# Altium schematic sheet Sheet1.SchDoc
size A3; SheetNumber: 1; SheetTotal: 1
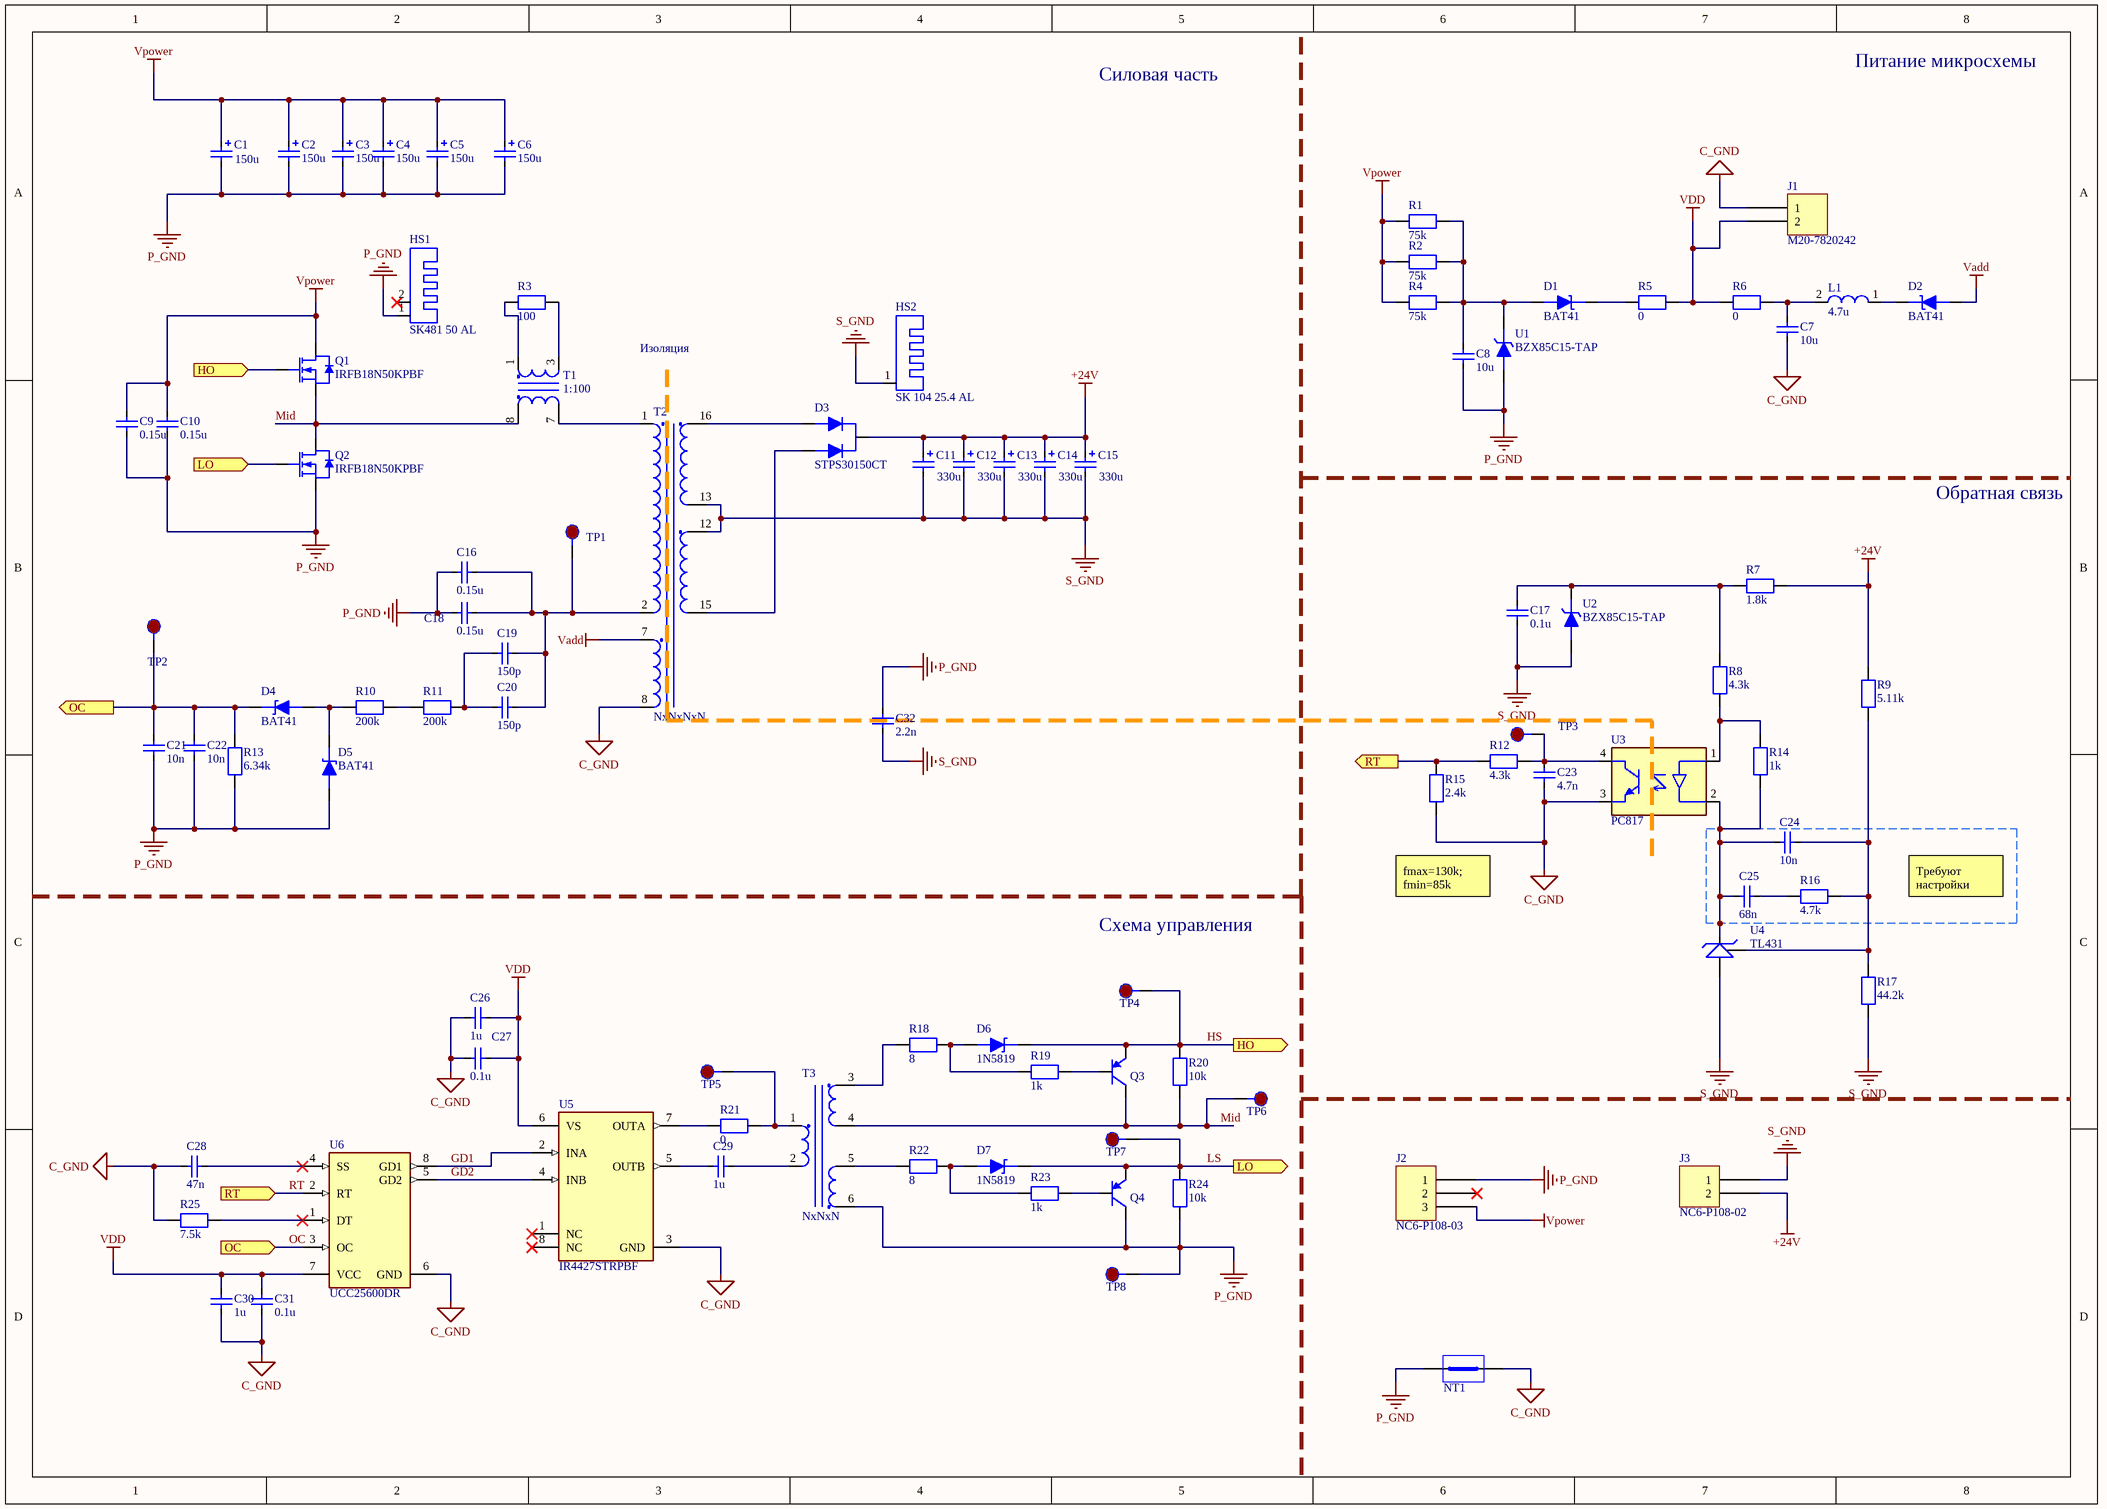
[diagram p0: Sheet1.SchDoc]

## Parts
C1  value 150u  [WCAP-AIL8]  (hidden comment: WCAP-AIL8)
C2  value 150u  [WCAP-AIL8]  (hidden comment: WCAP-AIL8)
C3  value 150u  [WCAP-AIL8]  (hidden comment: WCAP-AIL8)
C4  value 150u  [WCAP-AIL8]  (hidden comment: WCAP-AIL8)
C5  value 150u  [WCAP-AIL8]  (hidden comment: WCAP-AIL8)
C6  value 150u  [WCAP-AIL8]  (hidden comment: WCAP-AIL8)
C7  value 10u  [C322]  (hidden comment: К10-17Б 10 мкФ Y5V)
C8  value 10u  [C322]  (hidden comment: К10-17Б 10 мкФ Y5V)
C9  value 0.15u  [B32654A1154]  (hidden comment: B32654A1154)
C10  value 0.15u  [B32654A1154]  (hidden comment: B32654A1154)
C11  value 330u  [EKZN500ELL331MK16S]  (hidden comment: EKZN500ELL331MK16S)
C12  value 330u  [EKZN500ELL331MK16S]  (hidden comment: EKZN500ELL331MK16S)
C13  value 330u  [EKZN500ELL331MK16S]  (hidden comment: EKZN500ELL331MK16S)
C14  value 330u  [EKZN500ELL331MK16S]  (hidden comment: EKZN500ELL331MK16S)
C15  value 330u  [EKZN500ELL331MK16S]  (hidden comment: EKZN500ELL331MK16S)
C16  value 0.15u  [B32654A1154]  (hidden comment: B32654A1154)
C17  value 0.1u  [C322]  (hidden comment: К10-17Б 0.1 мкФ X7R)
C18  value 0.15u  [B32654A1154]  (hidden comment: B32654A1154)
C19  value 150p  [C322]  (hidden comment: К10-17Б 150pF NP0)
C20  value 150p  [C322]  (hidden comment: К10-17Б 150pF NP0)
C21  value 10n  [C322]  (hidden comment: К10-17Б 10 нФ X7R)
C22  value 10n  [C322]  (hidden comment: К10-17Б 10 нФ X7R)
C23  value 4.7n  [C322]  (hidden comment: К10-17Б 4.7 нФ X7R)
C24  value 10n  [C322]  (hidden comment: К10-17Б 10 нФ X7R)
C25  value 68n  [C322]  (hidden comment: К10-17Б 68 нФ X7R)
C26  value 1u  [CAP_1206]  (hidden comment: Конденсатор керамический smd 1 мкФ X7R)
C27  value 0.1u  [CAP_1206]  (hidden comment: Конденсатор керамический smd 0.1 мкФ X7R)
C28  value 47n  [CAP_1206]  (hidden comment: Конденсатор керамический smd 47 нФ X7R)
C29  value 1u  [C322]  (hidden comment: К10-17Б 1 мкФ X7R)
C30  value 1u  [CAP_1206]  (hidden comment: Конденсатор керамический smd 1 мкФ X7R)
C31  value 0.1u  [CAP_1206]  (hidden comment: Конденсатор керамический smd 0.1 мкФ X7R)
C32  value 2.2n  [F222K47S3NN63J7R]  (hidden comment: F222K47S3NN63J7R)
D1  BAT41  [DO-35]
D2  BAT41  [DO-35]
D3  STPS30150CT  [STPS30150CT]
D4  BAT41  [DO-35]
D5  BAT41  [DO-35]
D6  1N5819  [1N5819]
D7  1N5819  [1N5819]
HS1  SK481 50 AL  [SK481 50 AL]
HS2  SK 104 25.4 AL  [SK 104 25.4 AL]
J1  M20-7820242  [HARWIN M20-7820245]
J2  NC6-P108-03  [TE NC6-P108-03]
J3  NC6-P108-02  [TE NC6-P108-02]
L1  value 4.7u  [EC24]  (hidden comment: Inductor)
NT1  NT  [NT_20mil - TH]  (value not drawn)  (net tie, no BOM)
Q1  IRFB18N50KPBF  [TO-220]
Q2  IRFB18N50KPBF  [TO-220]
Q3  ZXTP2025FTA  [ZXTP2025FTA]  (value not drawn)
Q4  ZXTP2025FTA  [ZXTP2025FTA]  (value not drawn)
R1  value 75k  [C2-23-2]  (hidden comment: MO-200 2 Вт, 75 кОм, 5%)
R2  value 75k  [C2-23-2]  (hidden comment: MO-200 2 Вт, 75 кОм, 5%)
R3  value 100  [CMF55]  (hidden comment: MF-25 0.25 Вт, 100 Ом)
R4  value 75k  [C2-23-2]  (hidden comment: MO-200 2 Вт, 75 кОм, 5%)
R5  value 0  [MF0]  (hidden comment: MF-25 0.25 Вт, 0 Ом)
R6  value 0  [MF0]  (hidden comment: MF-25 0.25 Вт, 0 Ом)
R7  value 1.8k  [MF0]  (hidden comment: MF-25 0.25 Вт, 1.8 кОм)
R8  value 4.3k  [MF0]  (hidden comment: MF-25 0.25 Вт, 4.3 кОм)
R9  value 5.11k  [MF0]  (hidden comment: MF-25 0.25 Вт, 5.11 кОм, 1%)
R10  value 200k  [CMF55]  (hidden comment: CMF-55 0.5 Вт, 200 кОм, 1%)
R11  value 200k  [CMF55]  (hidden comment: CMF-55 0.5 Вт, 200 кОм, 1%)
R12  value 4.3k  [MF0]  (hidden comment: MF-25 0.25 Вт, 4.3 кОм)
R13  value 6.34k  [MF0]  (hidden comment: MF-25 0.25 Вт, 6.34 кОм, 1%)
R14  value 1k  [MF0]  (hidden comment: MF-25 0.25 Вт, 1 кОм, 1%)
R15  value 2.4k  [MF0]  (hidden comment: MF-25 0.25 Вт, 2.4 кОм, 1%)
R16  value 4.7k  [MF0]  (hidden comment: MF-25 0.25 Вт, 4.7 кОм, 1%)
R17  value 44.2k  [MF0]  (hidden comment: MF-25 0.25 Вт, 44.2 кОм, 1%)
R18  value 8  [MF0]  (hidden comment: MF-25 0.25 Вт, 8 Ом, 1%)
R19  value 1k  [MF0]  (hidden comment: MF-25 0.25 Вт, 1 кОм, 1%)
R20  value 10k  [MF0]  (hidden comment: MF-25 0.25 Вт, 10 кОм, 1%)
R21  value 0  [MF0]  (hidden comment: MF-25 0.25 Вт, 0 Ом)
R22  value 8  [MF0]  (hidden comment: MF-25 0.25 Вт, 8 Ом, 1%)
R23  value 1k  [MF0]  (hidden comment: MF-25 0.25 Вт, 1 кОм, 1%)
R24  value 10k  [MF0]  (hidden comment: MF-25 0.25 Вт, 10 кОм, 1%)
R25  value 7.5k  [RESC3016X06N]  (hidden comment: SMD 0.25 Вт, 7.5 кОм, 1%)
T1  1:100  [В82801В205А100]
T2  NxNxNxN  [ETD39 BOBBIN]
T3  NxNxN  [Trans2]
TP1  TP  [Test Point Hole]  (value not drawn)  (no BOM)
TP2  TP  [Test Point Hole]  (value not drawn)  (no BOM)
TP3  TP  [Test Point Hole]  (value not drawn)  (no BOM)
TP4  TP  [Test Point Hole]  (value not drawn)  (no BOM)
TP5  TP  [Test Point Hole]  (value not drawn)  (no BOM)
TP6  TP  [Test Point Hole]  (value not drawn)  (no BOM)
TP7  TP  [Test Point Hole]  (value not drawn)  (no BOM)
TP8  TP  [Test Point Hole]  (value not drawn)  (no BOM)
U1  BZX85C15-TAP  [BZX85C15-TAP]
U2  BZX85C15-TAP  [BZX85C15-TAP]
U3  PC817  [PC817]
U4  TL431  [TL431]
U5  IR4427STRPBF  [DIP-8]
U6  UCC25600DR  [SOIC-8]

## Ports
HO (in, see Sheet1[5C]), HO (out, see Sheet1[1A]), LO (in, see Sheet1[5D]), LO (out, see Sheet1[1B]), OC (in, see Sheet1[1B]), OC (out, see Sheet1[1D]), RT (in, see Sheet1[6C]), RT (out, see Sheet1[1D])

## Nets
+24V: C11.1 C12.1 C13.1 C14.1 C15.1 D3.K J3.2 R7.2 R9.2
C_GND: C7.2 C23.2 C26.1 C27.1 C28.2 C30.1 C31.1 J1.1 NT1.2 R15.1 R25.1 T2.8 U3.3 U5.3(GND) U6.6(GND)
P_GND: C1.2 C2.2 C3.2 C4.2 C5.2 C6.2 C8.2 C9.2 C10.2 C16.1 C18.1 C21.2 C22.2 C32.1 D5.2 HS1.1 J2.1 NT1.1 Q2.S Q4.3(C) R13.1 R24.1 T3.6 TP8.1 U1.2
S_GND: C11.2 C12.2 C13.2 C14.2 C15.2 C17.2 C32.2 HS2.1 J3.1 R17.1 T2.12 T2.13 U2.2 U4.2
Vadd: D2.2 T2.7
VDD: C26.2 C27.2 C30.2 C31.2 J1.2 R5.2 R6.1 U5.6(VS) U6.7(VCC)
Vpower: C1.1 C2.1 C3.1 C4.1 C5.1 C6.1 C9.1 C10.1 J2.3 Q1.D R1.1 R2.1 R4.1
GD1: U5.2(INA) U6.8(GD1)
GD2: U5.4(INB) U6.5(GD2)
HS: D6.1 Q1.G Q3.2(E) R20.2 TP4.1 ; port HO
LS: D7.1 Q2.G Q4.2(E) R24.2 TP7.1 ; port LO
Mid: Q1.S Q2.D Q3.3(C) R20.1 T1.8 T3.4 TP6.1
OC: C21.1 C22.1 D4.1 R13.2 TP2.1 U6.3(OC) ; port OC
RT: R12.2 R15.2 U6.2(RT) ; port RT
NetC7_1: C7.1 L1.2 R6.2
NetC8_1: C8.1 D1.2 R1.2 R2.2 R4.2 U1.1
NetC16_2: C16.2 C18.2 C19.2 C20.2 T2.2 TP1.1
NetC17_1: C17.1 R7.1 R8.2 U2.1
NetC19_1: C19.1 C20.1 R11.2
NetC23_1: C23.1 R12.1 TP3.1 U3.4
NetC24_1: C24.1 C25.1 R14.1 U3.2 U4.3
NetC24_2: C24.2 R9.1 R16.2 R17.2 U4.1
NetC25_2: C25.2 R16.1
NetC28_1: C28.1 U6.4(SS)
NetC29_1: C29.1 U5.5(OUTB)
NetC29_2: C29.2 T3.2
NetD1_1: D1.1 R5.1
NetD2_1: D2.1 L1.1
NetD3_A1: D3.A1(A) T2.16
NetD3_A2: D3.A2(A) T2.15
NetD4_2: D4.2 D5.1 R10.1
NetD6_2: D6.2 R18.2 R19.1
NetD7_2: D7.2 R22.2 R23.1
NetQ3_1: Q3.1(B) R19.2
NetQ4_1: Q4.1(B) R23.2
NetR3_1: R3.1 T1.1
NetR3_2: R3.2 T1.3
NetR8_1: R8.1 R14.2 U3.1
NetR10_2: R10.2 R11.1
NetR18_1: R18.1 T3.3
NetR21_1: R21.1 U5.7(OUTA)
NetR21_2: R21.2 T3.1 TP5.1
NetR22_1: R22.1 T3.5
NetR25_2: R25.2 U6.1(DT)
NetT1_7: T1.7 T2.1

Not connected (* = marked no-connect by the designer): HS1 2*; J2 2*; U5 1(NC)* 8(NC)*

## Notes on the sheet
- Силовая часть
- Питание микросхемы
- Изоляция
- Обратная связь
- fmax=130k; fmin=85k
- Требуют настройки
- Схема управления

## Library data of the parts
C7 C8 = К10-17Б 10 мкФ Y5V: Voltage: 50V
C11-C15 = EKZN500ELL331MK16S: Voltage: 50V
C17 = К10-17Б 0.1 мкФ X7R: Voltage: 50V
C19 C20 = К10-17Б 150pF NP0: Voltage: 500V
C21 C22 C24 = К10-17Б 10 нФ X7R: Voltage: 50V
C23 = К10-17Б 4.7 нФ X7R: Voltage: 50V
C25 = К10-17Б 68 нФ X7R: Voltage: 50V
C26 C30 = SMD 1206 1 мкФ X7R: Voltage: 50V
C27 C31 = SMD 1206 0.1 мкФ X7R: Voltage: 50V
C28 = SMD 1206 47 нФ X7R: Voltage: 50V
C29 = К10-17Б 1 мкФ X7R: Voltage: 50V
J1 = M20-7820242: CONN RCPT 2POS 0.1 GOLD PCB; Manufacturer: Harwin Inc.; Connector Type: Receptacle; Contact Length - Post: 0.118" (3.00mm); Current Rating (Amps): 3A; Mated Stacking Heights: 11.04mm, 12.63mm; Material Flammability Rating: UL94 V-0; Number of Positions: 2; Number of Positions Loaded: All; Pitch - Mating: 0.100" (2.54mm); Style: Board to Board or Cable; Part Number: M20-7820242; ComponentLink1Description: Datasheet; ComponentLink1URL: https://cdn.harwin.com/pdfs/C001XX_M20_Series_Connectors.pdf; ComponentLink2Description: DigiKey Link; ComponentLink2URL: https://www.digikey.com/en/products/detail/harwin-inc/M20-7820242/3727744; Contact Finish - Mating: Gold; Contact Finish - Post: Tin; Contact Finish Thickness - Mating: Flash; Contact Type: Female Socket; Fastening Type: Push-Pull; Insulation Color: Black; Insulation Height: 0.335" (8.51mm); LastUpdated: 21.09.2022 18:53:47; Lifecycle Status: Active; Minimum Order: 1; Mounting Type: Through Hole; Number of Rows: 1; Operating Temperature: -40°C ~ 105°C; Packaging: Tube; Part Status: Active; Price: 0.38; Series: M20; Supplier 1: DigiKey; Supplier Part Number 1: 952-1775-ND; Termination: Solder
J2 = NC6-P108-03: CONN BARRIER STRIP 3CIRC 0.375"; Manufacturer: TE Connectivity AMP Connectors; Barrier Type: 2 Wall (Dual); Bottom Termination: PC Pin; Current Rating (Amps): 20A; Number of Circuits: 3; Pitch: 0.375" (9.53mm); Top Termination: Screws with Captive Plate; Voltage Rating: 300V; Wire Gauge: 12-22 AWG; Part Number: NC6-P108-03; Color: Black; ComponentLink1Description: Datasheet; ComponentLink1URL: https://www.te.com/commerce/DocumentDelivery/DDEController?Action=srchrtrv&DocNm=3-1437664-0&DocType=Customer+Drawing&DocLang=English; ComponentLink2Description: DigiKey Link; ComponentLink2URL: http://digikey.com/product-detail/en/te-connectivity-amp-connectors/NC6-P108-03/A98496-ND/1277927; LastUpdated: 15.01.2020 4:12:05; Lifecycle Status: Active; Minimum Order: 1; Number of Rows: 1; Number of Wire Entries: 3; Packaging: Bulk; Part Status: Active; Price: 2.16; Series: NC6, Buchanan; Supplier 1: DigiKey; Supplier Part Number 1: A98496-ND; Terminal Block Type: Barrier Block
J3 = NC6-P108-02: CONN BARRIER STRIP 2CIRC 0.375"; Manufacturer: TE Connectivity AMP Connectors; Barrier Type: 2 Wall (Dual); Bottom Termination: PC Pin; Current Rating (Amps): 20A; Number of Circuits: 2; Pitch: 0.375" (9.53mm); Top Termination: Screws with Captive Plate; Voltage Rating: 300V; Wire Gauge: 12-22 AWG; Part Number: NC6-P108-02; Color: Black; ComponentLink1Description: Datasheet; ComponentLink1URL: https://www.te.com/commerce/DocumentDelivery/DDEController?Action=srchrtrv&DocNm=3-1437664-0&DocType=Customer+Drawing&DocLang=English; ComponentLink2Description: DigiKey Link; ComponentLink2URL: http://digikey.com/product-detail/en/te-connectivity-amp-connectors/NC6-P108-02/A98495-ND/1277926; LastUpdated: 15.01.2020 4:11:24; Lifecycle Status: Active; Minimum Order: 1; Number of Rows: 1; Number of Wire Entries: 2; Packaging: Bulk; Part Status: Active; Price: 1.56; Series: NC6, Buchanan; Supplier 1: DigiKey; Supplier Part Number 1: A98495-ND; Terminal Block Type: Barrier Block
Q1 Q2 = IRFB18N50KPBF: N-channel mosfet transistor; Source: *
R1 R2 R4 = MO-200 2 Вт, 75 кОм, 5%: Voltage: 750V; Source: *
R3 = MF-25 0.25 Вт, 100 Ом: Voltage: 250V; Source: *
R5 R6 R21 = MF-25 0.25 Вт, 0 Ом: Voltage: 250V; Source: *
R7 = MF-25 0.25 Вт, 1.8 кОм, 1%: Voltage: 250V; Source: *
R8 R12 = MF-25 0.25 Вт, 4.3 кОм, 1%: Voltage: 250V; Source: *
R9 = MF-25 0.25 Вт, 5.11 кОм, 1%: Voltage: 250V; Source: *
R10 R11 = CMF-55 0.5 Вт, 200 кОм, 1%: Voltage: 250V; Source: *
R13 = MF-25 0.25 Вт, 6.34 кОм, 1%: Voltage: 250V; Source: *
R14 R19 R23 = MF-25 0.25 Вт, 1 кОм, 1%: Voltage: 250V; Source: *
R15 = MF-25 0.25 Вт, 2.4 кОм, 1%: Voltage: 250V; Source: *
R16 = MF-25 0.25 Вт, 4.7 кОм, 1%: Voltage: 250V; Source: *
R17 = MF-25 0.25 Вт, 44.2 кОм, 1%: Voltage: 250V; Source: *
R18 R22 = MF-25 0.25 Вт, 8 Ом, 1%: Voltage: 250V; Source: *
R20 R24 = MF-25 0.25 Вт, 10 кОм, 1%: Voltage: 250V; Source: *
R25 = SMD 1206 0.25 Вт, 7.5 кОм, 1%: Voltage: 250V; Source: *
T1 = В82801В205А100
T2 = Transformer 1x3
T3 = Transformer 1x2
U5 = IR4427: IC GATE DRVR LOW-SIDE; Manufacturer: Infineon; Nominal Supply Current: 100uA; Rise Time: 15ns; Standoff Height: 0.1mm; Number Of Drivers: 2; Output Voltage: 6-20V; Fall Time: 10ns; Turn Off Delay Time: 65ns; Max Supply Voltage: 20V; Max Power Dissipation: 0.625W; Max Junction Temp: +150°C; Output Current: 1.5A; Min Supply Voltage: 6V; Turn On Delay Time: 85ns; Footprint Url: https://www.infineon.com/dgdl/Infineon-po-8leadsoic-P-v01_00-EN.pdf?fileId=5546d462580663ef0158068b4ad80177; Automotive: No; Height: 1.75mm; Ambient Temperature Range Low: -40°C; Temperature Range High: +150°C; Ambient Temperature Range High: +125°C; Package: PG-DSO-8; ComponentLink2Description: Datasheet; Digikey Description: IC GATE DRVR LOW-SIDE 8SOIC; Temperature: to +150°C; Number Of Outputs: 2; Device Class L2: Power Management ICs; Manufacturer Part Number: IR4427STRPBF; ComponentLink2URL: https://www.infineon.com/dgdl/ir4426.pdf?fileId=5546d462533600a4015355d60b491822; Category: IC; RoHS: TRUE; Device Class L1: Integrated Circuits (ICs); Ipc Land Pattern Name: SOIC127P600X155-8; Lead Free: Yes; Device Class L3: Gate Drivers; Octopart: https://octopart.com/ir4427strpbf-infineon-65873145
U6 = UCC25600DR: High-Performance Resonant Mode Controller with Voltage Control, 50 % Duty Cycle, -40 to +125 degC, 8-pin SOIC (D), Green (RoHS & no Sb/Br); Manufacturer: Texas Instruments; Rating: Catalog; Regulated Outputs(#): 2; UVLO Thresholds On/Off(V): 10.5/9.5; SubFamily: PWM Controller; Topology: Resonant, Half-Bridge; Duty Cycle(Max)(%): 50; Frequency(Max)(kHz): 350; PackageReference: D0008A; Mounting Technology: Surface Mount; PackageVersion: revM, Jun-2011; ComponentLink1Description: Datasheet; Code_JEDEC: MS-012AA; PartNumber: UCC25600DR; Control Method: Voltage; PackageDescription: 8-Pin Plastic Small Outline Integrated Circuit, 4.9 x 3.9 mm, Pitch 1.27 mm Pitch; Eco-Plan: Green (RoHS & no Sb/Br); ComponentLink1URL: http://www.ti.com/general/docs/lit/getliterature.tsp?genericPartNumber=UCC25600&fileType=pdf; DatasheetVersion: SLUS846B